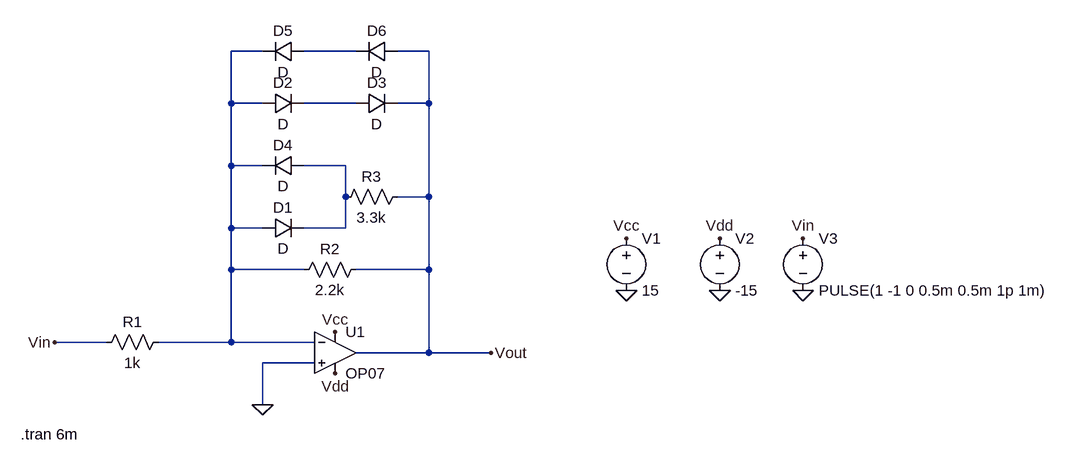
[diagram p0: schematic Conformateur.asc]
Conformateur.asc, the LTspice schematic file:
Version 4
SHEET 1 1456 680
WIRE 224 -272 176 -272
WIRE 368 -272 288 -272
WIRE 480 -272 432 -272
WIRE 176 -192 176 -272
WIRE 224 -192 176 -192
WIRE 368 -192 288 -192
WIRE 480 -192 480 -272
WIRE 480 -192 432 -192
WIRE 176 -96 176 -192
WIRE 224 -96 176 -96
WIRE 352 -96 288 -96
WIRE 352 -48 352 -96
WIRE 480 -48 480 -192
WIRE 480 -48 432 -48
WIRE 176 0 176 -96
WIRE 224 0 176 0
WIRE 352 0 352 -48
WIRE 352 0 288 0
WIRE 176 64 176 0
WIRE 288 64 176 64
WIRE 480 64 480 -48
WIRE 480 64 368 64
WIRE -16 176 -96 176
WIRE 176 176 176 64
WIRE 176 176 64 176
WIRE 304 176 176 176
WIRE 480 192 480 64
WIRE 480 192 368 192
WIRE 576 192 480 192
WIRE 304 208 224 208
WIRE 224 272 224 208
FLAG 224 272 0
FLAG -96 176 Vin
FLAG 576 192 Vout
FLAG 784 96 0
FLAG 928 96 0
FLAG 1056 96 0
FLAG 784 16 Vcc
FLAG 336 160 Vcc
FLAG 928 16 Vdd
FLAG 336 224 Vdd
FLAG 1056 16 Vin
SYMBOL res 80 160 R90
WINDOW 0 0 56 VBottom 2
WINDOW 3 32 56 VTop 2
SYMATTR InstName R1
SYMATTR Value 1k
SYMBOL Opamps\\OP07 336 128 R0
SYMATTR InstName U1
SYMBOL res 384 48 R90
WINDOW 0 0 56 VBottom 2
WINDOW 3 32 56 VTop 2
SYMATTR InstName R2
SYMATTR Value 2.2k
SYMBOL res 448 -64 R90
WINDOW 0 0 56 VBottom 2
WINDOW 3 32 56 VTop 2
SYMATTR InstName R3
SYMATTR Value 3.3k
SYMBOL diode 288 -112 R90
WINDOW 0 0 32 VBottom 2
WINDOW 3 32 32 VTop 2
SYMATTR InstName D4
SYMBOL diode 288 -288 R90
WINDOW 0 0 32 VBottom 2
WINDOW 3 32 32 VTop 2
SYMATTR InstName D5
SYMBOL diode 432 -288 R90
WINDOW 0 0 32 VBottom 2
WINDOW 3 32 32 VTop 2
SYMATTR InstName D6
SYMBOL diode 224 -176 R270
WINDOW 0 32 32 VTop 2
WINDOW 3 0 32 VBottom 2
SYMATTR InstName D2
SYMBOL diode 368 -176 R270
WINDOW 0 32 32 VTop 2
WINDOW 3 0 32 VBottom 2
SYMATTR InstName D3
SYMBOL diode 224 16 R270
WINDOW 0 32 32 VTop 2
WINDOW 3 0 32 VBottom 2
SYMATTR InstName D1
SYMBOL voltage 784 0 R0
WINDOW 123 0 0 Left 0
WINDOW 39 0 0 Left 0
SYMATTR InstName V1
SYMATTR Value 15
SYMBOL voltage 928 0 R0
WINDOW 123 0 0 Left 0
WINDOW 39 0 0 Left 0
SYMATTR InstName V2
SYMATTR Value -15
SYMBOL voltage 1056 0 R0
WINDOW 123 0 0 Left 0
WINDOW 39 0 0 Left 0
SYMATTR InstName V3
SYMATTR Value PULSE(1 -1 0 0.5m 0.5m 1p 1m)
TEXT -148 318 Left 2 !.tran 6m

The netlist it stands for:
* Conformateur.asc
R1 N001 Vin 1k
XU1 0 N001 Vcc Vdd Vout LT1001  ; OP07, pins In+ In- V+ V- OUT
R2 Vout N001 2.2k
R3 Vout N004 3.3k
D4 N004 N001 D
D5 N002 N001 D
D6 Vout N002 D
D2 N001 N003 D
D3 N003 Vout D
D1 N001 N004 D
V1 Vcc 0 15
V2 Vdd 0 -15
V3 Vin 0 PULSE(1 -1 0 0.5m 0.5m 1p 1m)
.model D D
.lib standard.dio
.tran 6m
.lib LTC.lib
.backanno
.end